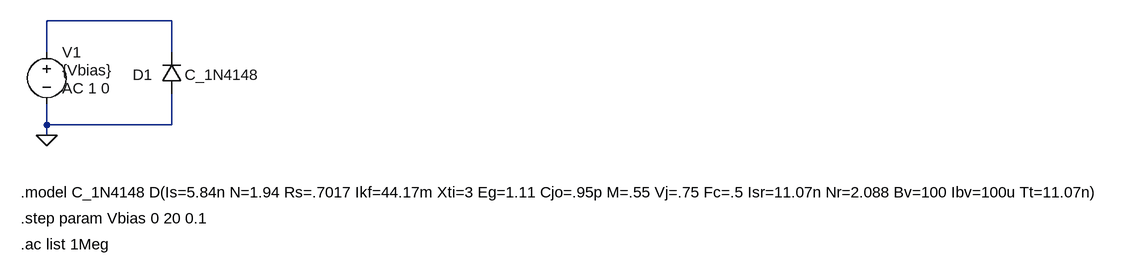
[diagram p0: schematic 1N4148_Capacitance.asc]
1N4148_Capacitance.asc, the LTspice schematic file:
Version 4.1
SHEET 1 1884 680
WIRE 256 64 64 64
WIRE 64 112 64 64
WIRE 256 112 256 64
WIRE 64 224 64 192
WIRE 256 224 256 176
WIRE 256 224 64 224
WIRE 64 240 64 224
FLAG 64 240 0
SYMBOL diode 272 176 R180
WINDOW 0 45 29 Left 2
WINDOW 3 -120 29 Left 2
SYMATTR InstName D1
SYMATTR Value C_1N4148
SYMBOL voltage 64 96 R0
WINDOW 3 24 44 Left 2
WINDOW 123 24 72 Left 2
WINDOW 39 0 0 Left 0
SYMATTR InstName V1
SYMATTR Value {Vbias}
SYMATTR Value2 AC 1 0
TEXT 24 328 Left 2 !.model C_1N4148 D(Is=5.84n N=1.94 Rs=.7017 Ikf=44.17m Xti=3 Eg=1.11 Cjo=.95p M=.55 Vj=.75 Fc=.5 Isr=11.07n Nr=2.088 Bv=100 Ibv=100u Tt=11.07n)
TEXT 24 368 Left 2 !.step param Vbias 0 20 0.1
TEXT 24 408 Left 2 !.ac list 1Meg

The netlist it stands for:
* 1N4148_Capacitance.asc
D1 0 N001 C_1N4148
V1 N001 0 {Vbias} AC 1 0
.model D D
.lib standard.dio
.model C_1N4148 D(Is=5.84n N=1.94 Rs=.7017 Ikf=44.17m Xti=3 Eg=1.11 Cjo=.95p M=.55 Vj=.75 Fc=.5 Isr=11.07n Nr=2.088 Bv=100 Ibv=100u Tt=11.07n)
.step param Vbias 0 20 0.1
.ac list 1Meg
.backanno
.end